# EasyEDA schematic Picobox.json
TITLE: PicoBox - Version: 1; REV: 1; Date: 2023-03-03; Sheet: 1/1; Company: pc
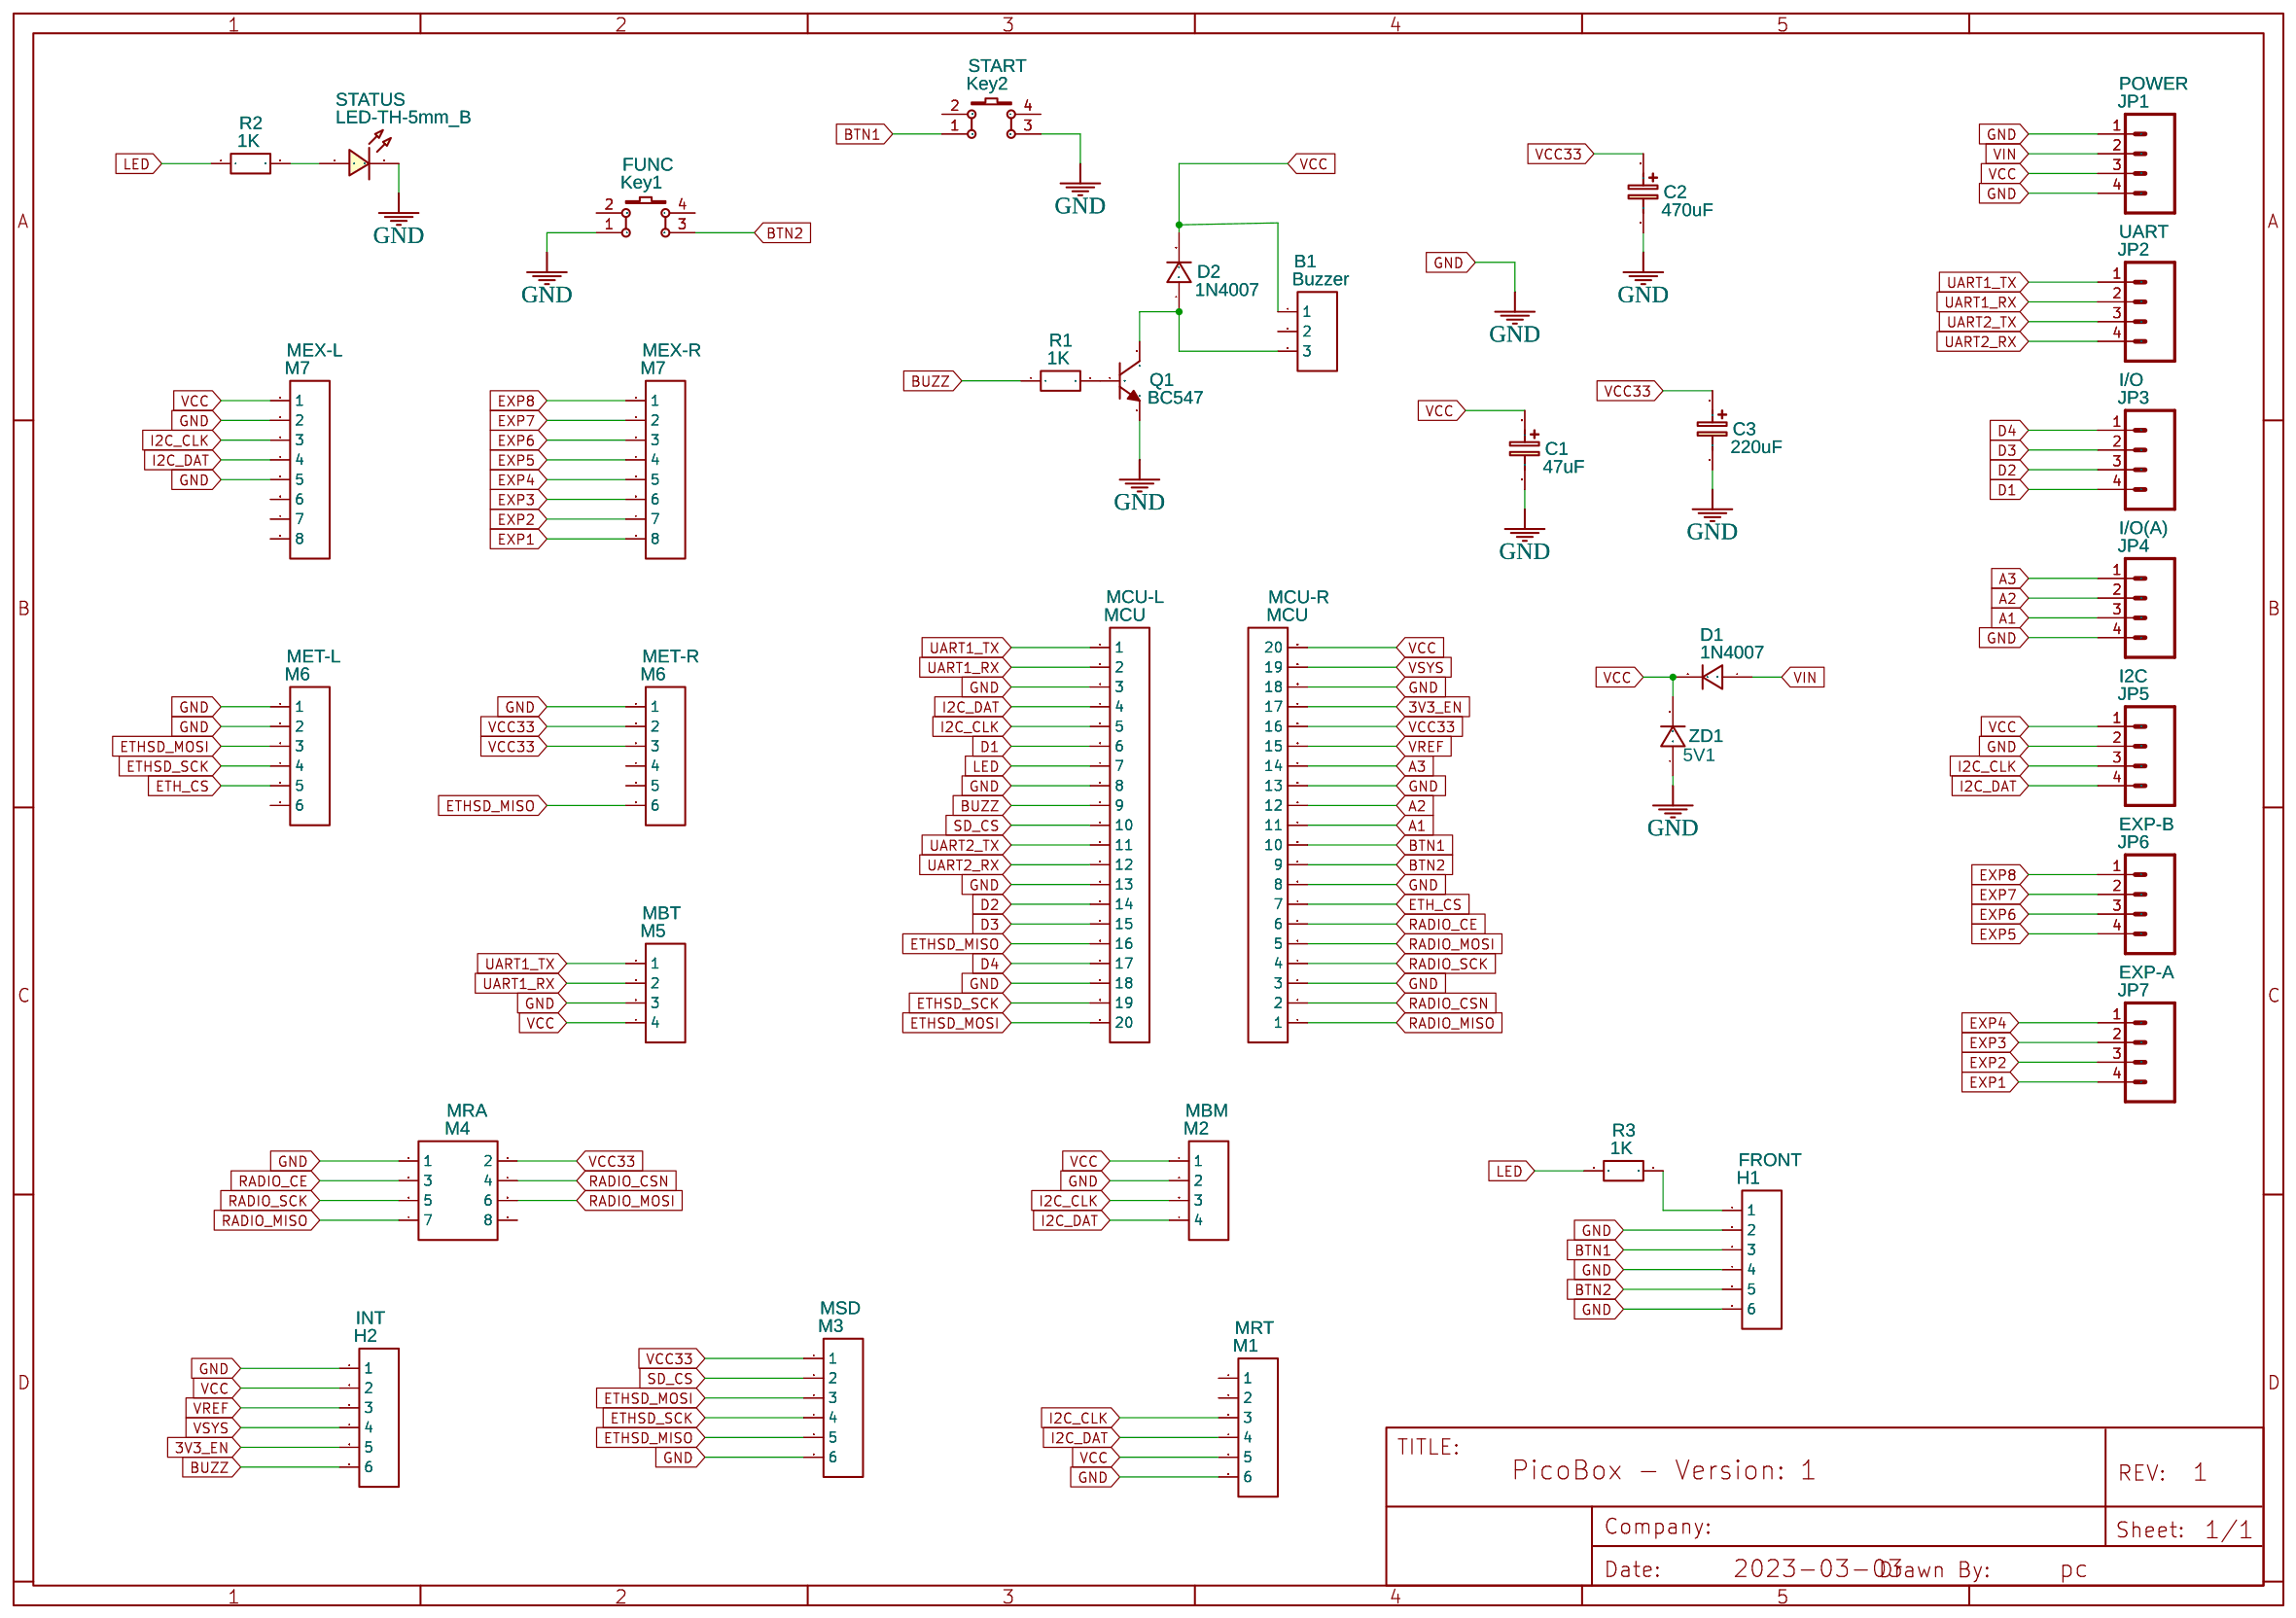
[diagram p0: schematic sheet]

## Parts
B1  Buzzer  [BEEPER]
C1  47uF  [ELECTCAPA]
C2  470uF  [ELECTCAPA]
C3  220uF  [ELECTCAPA]
D1  1N4007  [DIODE]
D2  1N4007  [DIODE]
EXP-A  JP7  [SCREWTERMINAL-3.5MM-4]
EXP-B  JP6  [SCREWTERMINAL-3.5MM-4]
FRONT  H1  [HDR-F-2.54_1X6]
FUNC  Key1  [KEY-TH_4P-L6.0-W6.0-P4.50-LS6.5]
I2C  JP5  [SCREWTERMINAL-3.5MM-4]
I/O  JP3  [SCREWTERMINAL-3.5MM-4]
I/O(A)  JP4  [SCREWTERMINAL-3.5MM-4]
INT  H2  [HDR-F-2.54_1X6]
MBM  M2  [HDR-F-2.54_1X4]
MBT  M5  [HDR-F-2.54_1X4]
MCU-L  MCU  [HDR-F-2.54_1X20]
MCU-R  MCU  [HDR-F-2.54_1X20]
MET-L  M6  [HDR-F-2.54_1X6]
MET-R  M6  [HDR-F-2.54_1X6]
MEX-L  M7  [HDR-F-2.54_1X8]
MEX-R  M7  [HDR-F-2.54_1X8]
MRA  M4  [HDR-F-2.54_2X4]
MRT  M1  [HDR-F-2.54_1X6]
MSD  M3  [HDR-F-2.54_1X6]
POWER  JP1  [SCREWTERMINAL-3.5MM-4]
Q1  BC547  [TO-92-2N2222]
R1  1K  [1/8W RESISTOR]
R2  1K  [1/8W RESISTOR]
R3  1K  [1/8W RESISTOR]
START  Key2  [KEY-TH_4P-L6.0-W6.0-P4.50-LS6.5]
STATUS  LED-TH-5mm_B  [LED-TH_BD5.0_GREEN]
UART  JP2  [SCREWTERMINAL-3.5MM-4]
ZD1  1N4001  [DIODE]

## Library data of the parts
B1 = HDR-F-2.54_1x3: Supplier Part: C146690; Supplier: LCSC; Contributor: LCEDA_Lib
C1-C3 = C_Tan_SMD_A_EU: Contributor: LCEDA_Lib
D1 D2 ZD1 = 1N4007W: Supplier: LCSC; Supplier Part: C328592; Manufacturer: BLUE ROCKET; Contributor: LCEDA_Lib
EXP-A EXP-B I2C I/O I/O(A) POWER UART = M04SCREW: Contributor: strojak
FRONT INT MET-L MET-R MRT MSD = HDR-F-2.54_1x6: Supplier Part: C40877; Supplier: LCSC; Contributor: LCEDA_Lib
FUNC START = K4-6×6_TH: Supplier: LCSC; Supplier Part: C136684; Manufacturer: 韩国韩荣; Manufacturer Part: K2-1102DP-E4SW-04; Contributor: LCEDA_Lib
MBM MBT = HDR-F-2.54_1x4: Supplier Part: C225501; Supplier: LCSC; Contributor: LCEDA_Lib
MCU-L = HDR-F-2.54_1x20: Supplier Part: C50984; Supplier: LCSC; Contributor: LCEDA_Lib; Package Display: No
MCU-R = HDR-F-2.54_1x20: Supplier Part: C50984; Supplier: LCSC; Contributor: LCEDA_Lib
MEX-L MEX-R = HDR-F-2.54_1x8: Supplier Part: C225505; Supplier: LCSC; Contributor: LCEDA_Lib
MRA = HDR-F-2.54_2x4: Supplier Part: C239344; Supplier: LCSC; Contributor: LCEDA_Lib
Q1 = 2N3904(SOT-23): Supplier: LCSC; Manufacturer: KEC; Manufacturer Part: 2n3904S-RTK/PS; Supplier Part: C18536; Paste Type: SOT-23; Contributor: LCEDA_Lib
R1-R3 = R_0603_EU: Contributor: LCEDA_Lib
STATUS = LED-TH-5mm_G: Manufacturer: EVERLIGHT(台湾亿光); Manufacturer Part: 333-2SYGD/S530-E2; Supplier Part: C88163; Supplier: LCSC; Contributor: LCEDA_Lib

## Nets
3V3_EN: INT.5 MCU-R.17
GND: C1.VSS(2) C2.VSS(2) C3.VSS(2) FRONT.2 FRONT.4 FRONT.6 FUNC.1 I2C.2 I/O(A).4 INT.1 MBM.2 MBT.3 MCU-L.3 MCU-L.8 MCU-L.13 MCU-L.18 MCU-R.3 MCU-R.8 MCU-R.13 MCU-R.18 MET-L.1 MET-L.2 MET-R.1 MEX-L.2 MEX-L.5 MRA.1 MRT.6 MSD.6 POWER.1 POWER.4 Q1.1(E) START.3 STATUS.2 ZD1.A(2)
VCC: B1.1 C1.VDD(1) D1.C(1) D2.C(1) I2C.1 INT.2 MBM.1 MBT.4 MCU-R.20 MEX-L.1 MRT.5 POWER.3 ZD1.C(1)
VCC33: C2.VDD(1) C3.VDD(1) MCU-R.16 MET-R.2 MET-R.3 MRA.2 MSD.1
VIN: D1.A(2) POWER.2
A1: I/O(A).3 MCU-R.11
A2: I/O(A).2 MCU-R.12
A3: I/O(A).1 MCU-R.14
BTN1: FRONT.3 MCU-R.10 START.1
BTN2: FRONT.5 FUNC.3 MCU-R.9
BUZZ: INT.6 MCU-L.9 R1.1
D1: I/O.4 MCU-L.6
D2: I/O.3 MCU-L.14
D3: I/O.2 MCU-L.15
D4: I/O.1 MCU-L.17
ETH_CS: MCU-R.7 MET-L.5
ETHSD_MISO: MCU-L.16 MET-R.6 MSD.5
ETHSD_MOSI: MCU-L.20 MET-L.3 MSD.3
ETHSD_SCK: MCU-L.19 MET-L.4 MSD.4
EXP1: EXP-A.4 MEX-R.8
EXP2: EXP-A.3 MEX-R.7
EXP3: EXP-A.2 MEX-R.6
EXP4: EXP-A.1 MEX-R.5
EXP5: EXP-B.4 MEX-R.4
EXP6: EXP-B.3 MEX-R.3
EXP7: EXP-B.2 MEX-R.2
EXP8: EXP-B.1 MEX-R.1
I2C_CLK: I2C.3 MBM.3 MCU-L.5 MEX-L.3 MRT.3
I2C_DAT: I2C.4 MBM.4 MCU-L.4 MEX-L.4 MRT.4
LED: MCU-L.7 R2.1 R3.1
RADIO_CE: MCU-R.6 MRA.3
RADIO_CSN: MCU-R.2 MRA.4
RADIO_MISO: MCU-R.1 MRA.7
RADIO_MOSI: MCU-R.5 MRA.6
RADIO_SCK: MCU-R.4 MRA.5
SD_CS: MCU-L.10 MSD.2
UART1_RX: MBT.2 MCU-L.2 UART.2
UART1_TX: MBT.1 MCU-L.1 UART.1
UART2_RX: MCU-L.12 UART.4
UART2_TX: MCU-L.11 UART.3
VREF: INT.3 MCU-R.15
VSYS: INT.4 MCU-R.19
Net-(B1-2): B1.2 D2.A(2) Q1.3(C)
Net-(FRONT-1): FRONT.1 R3.2
Net-(Q1-2): Q1.2(B) R1.2
Net-(R2-2): R2.2 STATUS.1

Not connected (* = marked no-connect by the designer): FUNC 2 4; MET-L 6; MET-R 4 5; MEX-L 6 7 8; MRA 8; MRT 1 2; START 2 4

## Notes on the sheet
- 5V1
